# Altium schematic sheet Adafruit PCA9685 rev C.SchDoc: Adafruit PCA9685 rev C
size 282 x 200 mm; Date: 04/12/2018 1:15:42 PM; Author: >AUTHOR; SheetNumber: 1
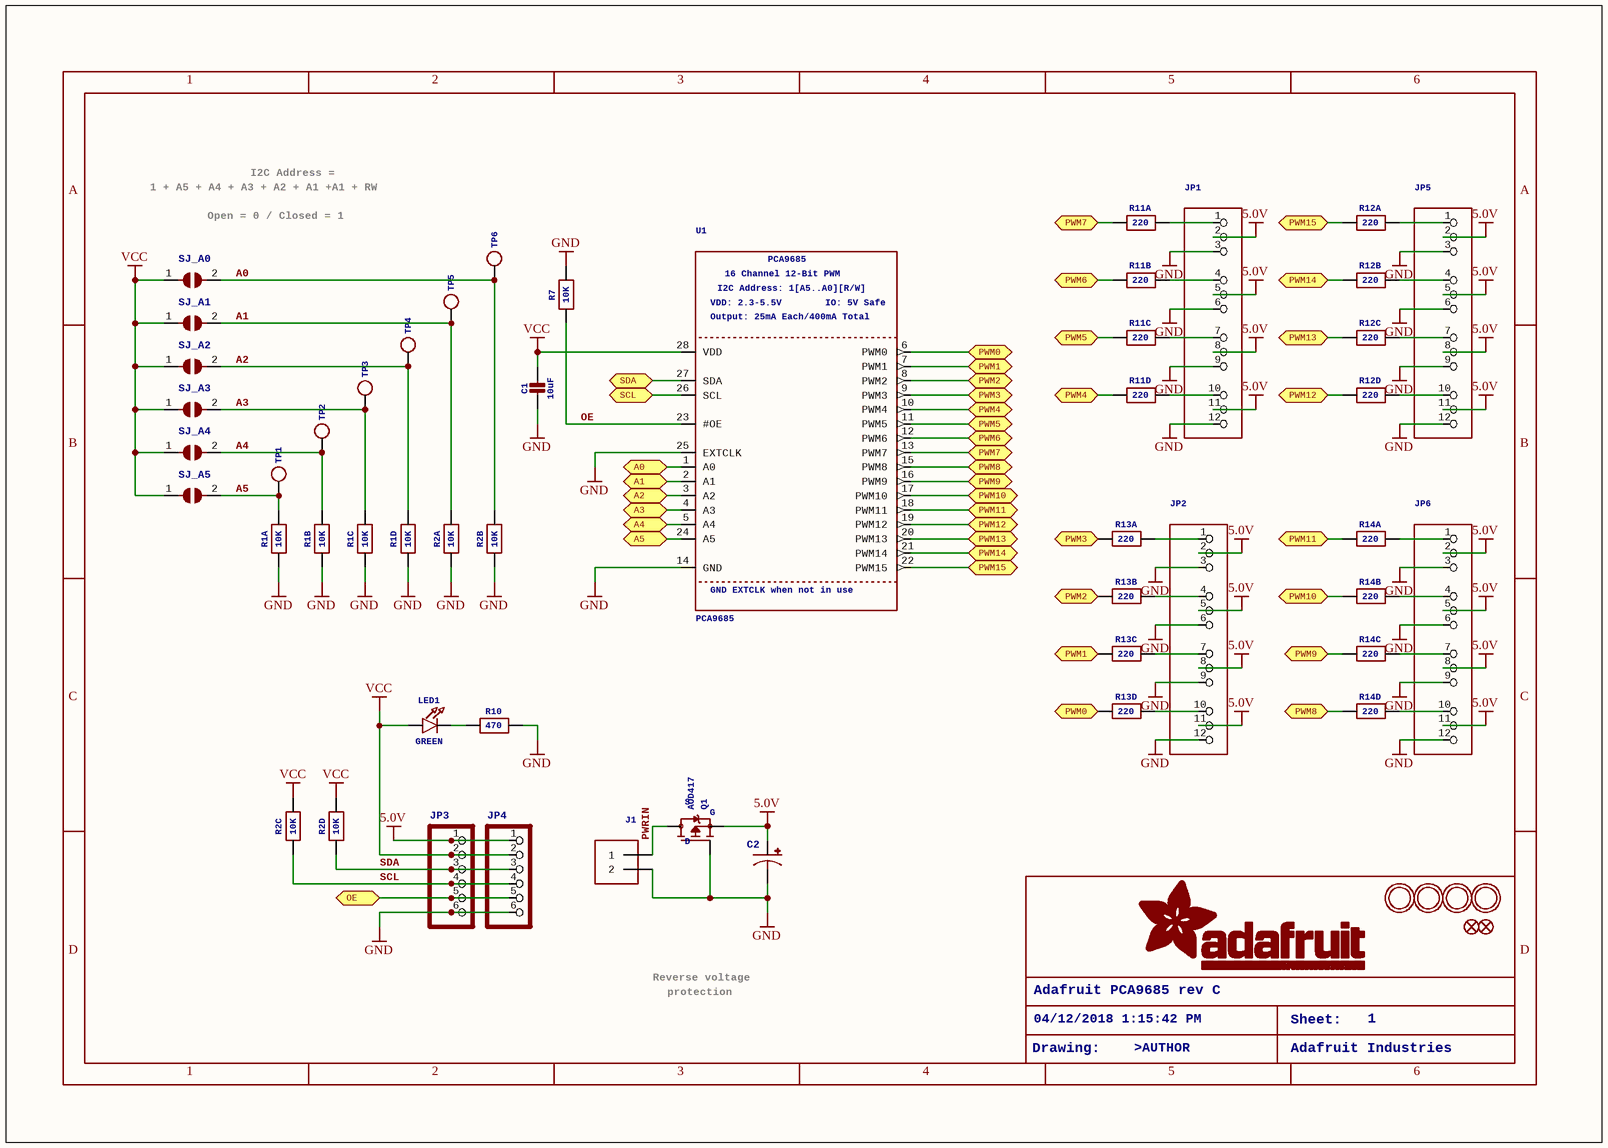
[diagram p0: Adafruit PCA9685 rev C.SchDoc]

## Parts
C1  10uF  [0805-NO]
C2  CPOL-USE3.5-8  [E3,5-8]  (value not drawn)
FID1  FIDUCIAL""  [FIDUCIAL_1MM]  (value not drawn)
FID2  FIDUCIAL""  [FIDUCIAL_1MM]  (value not drawn)
J1  TERMBLOCK_1X2  [TERMBLOCK_1X2-3.5MM]  (value not drawn)
JP1  HEADER-3X04  [3X04]  (value not drawn)
JP2  HEADER-3X04  [3X04]  (value not drawn)
JP3  PINHD-1X6CB  [1X06-CLEANBIG]  (value not drawn)
JP4  PINHD-1X6CB  [1X06-CLEANBIG]  (value not drawn)
JP5  HEADER-3X04  [3X04]  (value not drawn)
JP6  HEADER-3X04  [3X04]  (value not drawn)
LED1  GREEN  [CHIPLED_0805_NOOUTLINE]
Q1  AOD417  [TO252]
R1  10K  [RESPACK_4X0603]  (parts A,B,C,D of 4)
R2  10K  [RESPACK_4X0603]  (parts A,B,C,D of 4)
R7  10K  [0805-NO]
R10  470  [_0805MP]
R11  220  [RESPACK_4X0603]  (parts A,B,C,D of 4)
R12  220  [RESPACK_4X0603]  (parts A,B,C,D of 4)
R13  220  [RESPACK_4X0603]  (parts A,B,C,D of 4)
R14  220  [RESPACK_4X0603]  (parts A,B,C,D of 4)
SJ_A0  SOLDERJUMPERREFLOW_NOPASTE  [SOLDERJUMPER_REFLOW_NOPASTE]  (value not drawn)
SJ_A1  SOLDERJUMPERREFLOW_NOPASTE  [SOLDERJUMPER_REFLOW_NOPASTE]  (value not drawn)
SJ_A2  SOLDERJUMPERREFLOW_NOPASTE  [SOLDERJUMPER_REFLOW_NOPASTE]  (value not drawn)
SJ_A3  SOLDERJUMPERREFLOW_NOPASTE  [SOLDERJUMPER_REFLOW_NOPASTE]  (value not drawn)
SJ_A4  SOLDERJUMPERREFLOW_NOPASTE  [SOLDERJUMPER_REFLOW_NOPASTE]  (value not drawn)
SJ_A5  SOLDERJUMPERREFLOW_NOPASTE  [SOLDERJUMPER_REFLOW_NOPASTE]  (value not drawn)
TP1  TESTPOINTROUND1MM  [TESTPOINT_ROUND_1MM]  (value not drawn)
TP2  TESTPOINTROUND1MM  [TESTPOINT_ROUND_1MM]  (value not drawn)
TP3  TESTPOINTROUND1MM  [TESTPOINT_ROUND_1MM]  (value not drawn)
TP4  TESTPOINTROUND1MM  [TESTPOINT_ROUND_1MM]  (value not drawn)
TP5  TESTPOINTROUND1MM  [TESTPOINT_ROUND_1MM]  (value not drawn)
TP6  TESTPOINTROUND1MM  [TESTPOINT_ROUND_1MM]  (value not drawn)
U1  PCA9685  16Channel12-BitPWM: 16 Channel 12-Bit PWM  VDD:2.3-5.5V: VDD: 2.3-5.5V  IO:5VSafe: IO: 5V Safe  Output:25mAEach/400mATotal: Output: 25mA Each/400mA Total  GNDEXTCLKwhennotinuse!: GND EXTCLK when not in use  I2CAddress:1[A5..A0][R/W]: I2C Address: 1[A5..A0][R/W]  [TSSOP28]
U$47  MOUNTINGHOLE2.5  [MOUNTINGHOLE_2.5_PLATED]  (value not drawn)
U$48  MOUNTINGHOLE2.5  [MOUNTINGHOLE_2.5_PLATED]  (value not drawn)
U$49  MOUNTINGHOLE2.5  [MOUNTINGHOLE_2.5_PLATED]  (value not drawn)
U$50  MOUNTINGHOLE2.5  [MOUNTINGHOLE_2.5_PLATED]  (value not drawn)

## Ports
A0, A1, A2, A3, A4, A5, OE, PWM0, PWM1, PWM2, PWM3, PWM4, PWM5, PWM6, PWM7, PWM8, PWM9, PWM10, PWM11, PWM12, PWM13, PWM14, PWM15, SCL, SDA

## Nets
5.0V: C2.+ JP1.2 JP1.5 JP1.8 JP1.11 JP2.2 JP2.5 JP2.8 JP2.11 JP3.1 JP4.1 JP5.2 JP5.5 JP5.8 JP5.11 JP6.2 JP6.5 JP6.8 JP6.11 Q1.2(S)
GND: C1.2 C2.- J1.2 JP1.3 JP1.6 JP1.9 JP1.12 JP2.3 JP2.6 JP2.9 JP2.12 JP3.6 JP4.6 JP5.3 JP5.6 JP5.9 JP5.12 JP6.3 JP6.6 JP6.9 JP6.12 Q1.1(G) R1.1 R1.2 R1.3 R1.4 R2.1 R2.2 R7.2 R10.2 U1.14(GND) U1.25(EXTCLK)
VCC: C1.1 JP3.2 JP4.2 LED1.A R2.5 R2.6 SJ_A0.1 SJ_A1.1 SJ_A2.1 SJ_A3.1 SJ_A4.1 SJ_A5.1 U1.28(VDD)
A0: U1.1(A0) ; port A0
A0: R2.7 SJ_A0.2 TP6.P$1  [a separate net that carries the same name]
A1: U1.2(A1) ; port A1
A1: R2.8 SJ_A1.2 TP5.P$1  [a separate net that carries the same name]
A2: U1.3(A2) ; port A2
A2: R1.5 SJ_A2.2 TP4.P$1  [a separate net that carries the same name]
A3: U1.4(A3) ; port A3
A3: R1.6 SJ_A3.2 TP3.P$1  [a separate net that carries the same name]
A4: U1.5(A4) ; port A4
A4: R1.7 SJ_A4.2 TP2.P$1  [a separate net that carries the same name]
A5: U1.24(A5) ; port A5
A5: R1.8 SJ_A5.2 TP1.P$1  [a separate net that carries the same name]
OE: R7.1 U1.23(#OE)
OE: JP3.5 JP4.5 ; port OE  [a separate net that carries the same name]
PWM0: R13.4 U1.6(PWM0) ; port PWM0
PWM1: R13.3 U1.7(PWM1) ; port PWM1
PWM2: R13.2 U1.8(PWM2) ; port PWM2
PWM3: R13.1 U1.9(PWM3) ; port PWM3
PWM4: R11.4 U1.10(PWM4) ; port PWM4
PWM5: R11.3 U1.11(PWM5) ; port PWM5
PWM6: R11.2 U1.12(PWM6) ; port PWM6
PWM7: R11.1 U1.13(PWM7) ; port PWM7
PWM8: R14.4 U1.15(PWM8) ; port PWM8
PWM9: R14.3 U1.16(PWM9) ; port PWM9
PWM10: R14.2 U1.17(PWM10) ; port PWM10
PWM11: R14.1 U1.18(PWM11) ; port PWM11
PWM12: R12.4 U1.19(PWM12) ; port PWM12
PWM13: R12.3 U1.20(PWM13) ; port PWM13
PWM14: R12.2 U1.21(PWM14) ; port PWM14
PWM15: R12.1 U1.22(PWM15) ; port PWM15
PWRIN: J1.1 Q1.3(D)
SCL: U1.26(SCL) ; port SCL
SCL: JP3.4 JP4.4 R2.3  [a separate net that carries the same name]
SDA: U1.27(SDA) ; port SDA
SDA: JP3.3 JP4.3 R2.4  [a separate net that carries the same name]
NetJP1_1: JP1.1 R11.8
NetJP1_4: JP1.4 R11.7
NetJP1_7: JP1.7 R11.6
NetJP1_10: JP1.10 R11.5
NetJP2_1: JP2.1 R13.8
NetJP2_4: JP2.4 R13.7
NetJP2_7: JP2.7 R13.6
NetJP2_10: JP2.10 R13.5
NetJP5_1: JP5.1 R12.8
NetJP5_4: JP5.4 R12.7
NetJP5_7: JP5.7 R12.6
NetJP5_10: JP5.10 R12.5
NetJP6_1: JP6.1 R14.8
NetJP6_4: JP6.4 R14.7
NetJP6_7: JP6.7 R14.6
NetJP6_10: JP6.10 R14.5
NetLED1_C: LED1.C R10.1

## Notes on the sheet
- 1 + A5 + A4 + A3 + A2 + A1 +A1 + RW
- Open = 0 / Closed = 1
- I2C Address =
- Reverse voltage
- protection
- Adafruit PCA9685 rev C
- 04/12/2018 1:15:42 PM
- Sheet:
- 1
- Drawing:
- >AUTHOR
- Adafruit Industries
- 2
- 3
- 4
- 5
- 6
- A
- B
- C
- D

## Library data of the parts
C1 = CAP_CERAMIC0805-NOOUTLINE: Ceramic Capacitors   For new designs, use the packages preceded by an '_' character since they are more reliable:   The following footprints should be used on most boards: _0402 - Standard footprint for regular board layouts  _0603 - Standard footprint for regular board layouts  _0805 - Standard footprint for regular board layouts  _1206 - Standard footprint for regular board layouts       For extremely tight-pitch boards where space is at a premium, the following 'micro-pitch' footprints can be used (smaller pads, no silkscreen outline, etc.): _0402MP - Micro-pitch footprint for very dense/compact boards  _0603MP - Micro-pitch footprint for very dense/compact boards  _0805MP - Micro-pitch footprint for very dense/compact boards  _1206MP - Micro-pitch footprint for very dense/compact boards
C2 = CPOL-USE3.5-8: POLARIZED CAPACITOR, American symbol
FID1 FID2 = FIDUCIAL"": Fiducial Alignment Points   Various fiducial points for machine vision alignment.; BOM: EXCLUDE
J1 = TERMBLOCK_1X2: 3.5mm Terminal block    http://www.ladyada.net/library/pcb/eaglelibrary.html
JP3 JP4 = PINHD-1X6CB: PIN HEADER
LED1 = LED0805_NOOUTLINE: LED0603 - 0603 Surface Mount Package    2mA: Green LED - Low Power (3.9mcd, 2ma, 1.7Vf) - Digikey: 475-2709-2-ND  Orange LED - Low Power (9.8mcd, 2ma, 1.8Vf) - Digikey: 475-1194-2-ND  Red LED - Low Power (5mcd, 2ma, 1.8Vf) - Digikey: 475-1195-2-ND  Yellow LED - Low Power (7mcd, 2ma, 1.8Vf) - Digikey: 475-1196-2-ND       5mA: Blue LED - Low Power (17mcd, 5ma, 2.9Vf) - Digikey: LNJ937W8CRACT-ND    0805 - 0805 Surface Mount Package    2mA: Red LED (8.8mcd, 2mA, 1.8Vf, Clear) - Low Power [Digikey: 475-2510-1-ND]  Green LED (5mcd, 2mA, 1.8Vf, Clear) - Low Power [Digikey: 475-2730-1-ND]  Yellow LED (11.3mcd, 2mA, 1.8Vf, Clear) - Low Power [Digikey: 475-2555-1-ND]       20mA: Red LED (104mcd, 20mA, Diffused) - LS R976 [Digikey: 475-1278-6-ND]  Red LED (12mcd, 20mA, 2.0Vf, Clear) - APT2012EC [Digikey: 754-1128-1-ND]  Green LED (15mcd, 20mA, 2.2Vf, Clear) - APT2012GC [Digikey: 754-1131-1-ND]  Orange LED (160mcd, 20mA, 2.1Vf, Clear) - APT2012SECK [Digikey: 754-1130-1-ND]     1206 - 1206 Surface Mount Package  Green LED (26mcd, 20mA, Diffused) - LG N971  [Digikey: 475-1407-6-ND]  Red LED (15mcd, 20mA, Diffused) - LH N974 [Digikey: 475-1416-6-ND]     Cree - Cree High-Power Surface Mount LEDs  XPEBWT-L1-0000-00D50 - White 111lm 350mA 2.9Vf 6200K 110Â°  XTEAWT-00-0000-00000LEE3 - White 114lm 350mA 2.85Vf 5000K 115Â°     Everlight - Everlight 45-21 Series Surface Mount LEDs  45-21/QK2C-B2832AC2CB2/2T - Warm White 2000mcd 20mA 3.25Vf 3050K 120Â°  45-21/LK2C-B38452C4CB2/2T - Nuetral White 2000mcd 20mA 3.25Vf 4150K 120Â°  45-21/LK2C-B50634C6CB2/2T - Cold White 2200mcd 20mA 3.25Vf 5650K 120Â°     PLCC2 Reverse Mount LS T77K-J1L2-1-0-2-R18-Z - Red 11.25mcd 2mA 1.8Vf 630nm 120Â°  LO T77K-L1M2-24-Z - Orange 19.6mcd 2mA 1.8Vf 606nm 120Â°  LY T77K-K2M1-26-Z - Yellow 15.7mcd 2mA 1.8Vf 587nm 120Â°
Q1 = MOSFET-PTO252: P-Channel Mosfet   LEGEND   VDS: Voltage Drain-Source ID: Drain Current RDS(ON): Drain-Source On-State Resistance VGS(TH): Gate-Source Threshold Voltage CISS: Drain-Source Input Capacitance    SOT-23   Name	VDS	ID	RDS(ON)	VGS(TH)	CISS	Order Number	   IRLML5103	30V	760mA	600 mOhm	--	75pF @ 25V	Digikey: IRLML5103PBFCT-ND	   IRLML6401	12V	4.3A	50 mOhm	950mV @ 250ÂµA	830pF @ 10V	Digikey: IRLML6401PBFTR-ND	   NTR0202PL	20V	400mA	800 mOhm	2.3V @ 250uA	70pF @ 5V	Digikey: NTR0202PLT1GOSTR-ND	   NTR4101PT1G	20V	1.8A	85 mOhm	1.2V @ 250uA	675pF @ 10V	Digikey: NTR4101PT1GOSCT-ND	   DMP2004K	20V	600mA	900 mOhm	1V @ 250uA	175pF @ 16V	Digikey: DMP2004KDICT-ND	   PMV65XP	20V	3.9A	76 mOhm	950mV @ 1mA	725pF @ 20V	Digikey: 568-2358-2-ND	   							   							TO-252   Name	VDS	ID	RDS(ON)	VGS(TH)	CISS	Order Number	   AOD417	30V	25A	34 mOhm	3V @ 250ÂµA	920pF @ 15V	Digikey: 785-1106-2-ND; D: D; S: S; G: G
R1 R2 R11-R14 = RESISTOR_4PACK: Resistor Packs (4 resistors)   4 x 0603 10K 1/16W - Digikey: YC164J-10KCT-ND
R7 = RESISTOR0805_NOOUTLINE: Resistors   For new designs, use the packages preceded by an '_' character since they are more reliable:   The following footprints should be used on most boards: _0402 - Standard footprint for regular board layouts  _0603 - Standard footprint for regular board layouts  _0805 - Standard footprint for regular board layouts  _1206 - Standard footprint for regular board layouts       For extremely tight-pitch boards where space is at a premium, the following 'micro-pitch' footprints can be used (smaller pads, no silkscreen outline, etc.): _0402MP - Micro-pitch footprint for very dense/compact boards  _0603MP - Micro-pitch footprint for very dense/compact boards  _0805MP - Micro-pitch footprint for very dense/compact boards  _1206MP - Micro-pitch footprint for very dense/compact boards
R10 = RESISTOR_0805MP: Resistors   For new designs, use the packages preceded by an '_' character since they are more reliable:   The following footprints should be used on most boards: _0402 - Standard footprint for regular board layouts  _0603 - Standard footprint for regular board layouts  _0805 - Standard footprint for regular board layouts  _1206 - Standard footprint for regular board layouts       For extremely tight-pitch boards where space is at a premium, the following 'micro-pitch' footprints can be used (smaller pads, no silkscreen outline, etc.): _0402MP - Micro-pitch footprint for very dense/compact boards  _0603MP - Micro-pitch footprint for very dense/compact boards  _0805MP - Micro-pitch footprint for very dense/compact boards  _1206MP - Micro-pitch footprint for very dense/compact boards
SJ_A0-SJ_A5 = SOLDERJUMPERREFLOW_NOPASTE: SMD Solder JUMPER   Solder the two pads together to create a connection, or remove the solder to break it.REFLOW - Use this footprint for solder paste and reflow ovens. WAVE - Use this footprint for hand-soldering (larger pads).    CLOSED - Has a trace between the two pads to ensure it is closed by default.  The trace needs to be cut to disable the jumper, and can be closed again by creating a solder bridge between the two pads.
TP1-TP6 = TESTPOINTROUND1MM: Test Point   Various test points for characterisation and PCB testing    TESTPOINT_SMT - Compact Surface Mount Test Point [Digikey: 5016KTR-ND]
U1 = PCA9685: PCA9685 - 16 Channel 12-Bit I2C PWM Controller    5.0V tolerant 16 channel, 12-bit I2C PWM controller with 25mA per output (max. 400mA total)   Digikey: 568-5931-1-ND; PCA9685: PCA9685
U$47-U$50 = MOUNTINGHOLE2.5: Mounting Hole   For #2 screws (0.086"/2.18mm width, 0.094"/2.4mm hole) use 2.5mm; BOM: EXCLUDE